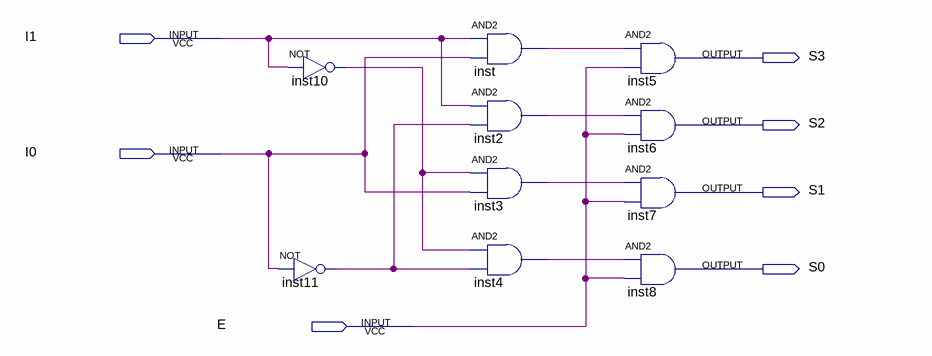
[diagram p0: schematic sheet]
// Quartus schematic decodificador2-4.bdf as structural Verilog: 10 symbols, 7 pins
module \decodificador2-4  (
  input  I1,
  input  I0,
  input  E,
  output S3,
  output S2,
  output S1,
  output S0
);

  wire inst2_out, inst3_out, inst4_out, inst10_out, inst11_out, inst_out;

  not inst11 (inst11_out, I0);
  not inst10 (inst10_out, I1);
  and inst (inst_out, I1, I0);
  and inst2 (inst2_out, I1, inst11_out);
  and inst3 (inst3_out, inst10_out, I0);
  and inst4 (inst4_out, inst10_out, inst11_out);
  and inst5 (S3, inst_out, E);
  and inst6 (S2, inst2_out, E);
  and inst7 (S1, inst3_out, E);
  and inst8 (S0, inst4_out, E);
endmodule
